# Altium project Powersupply.PrjPcb (part 2 of 2)

## Sheet Controll.SchDoc
size A1
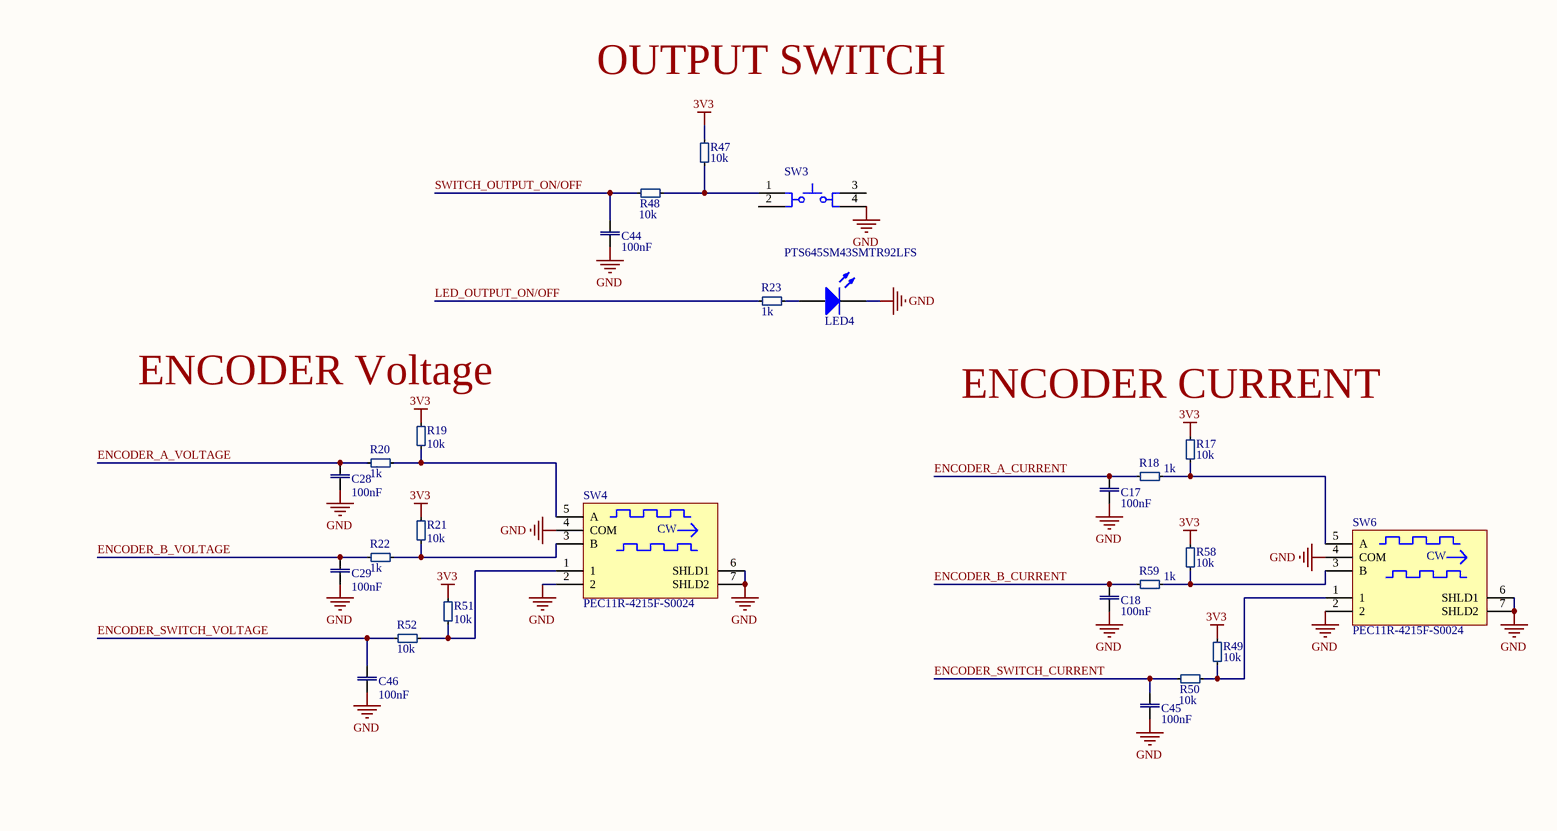
[diagram p4: Controll.SchDoc, top left]
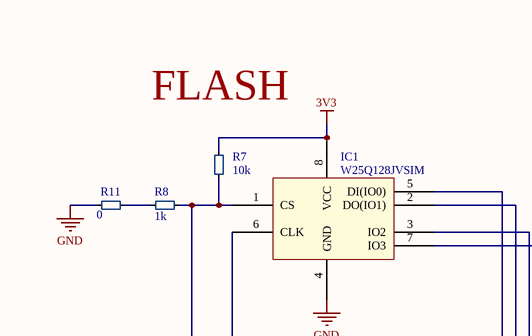
[diagram p5: Controll.SchDoc, top right]
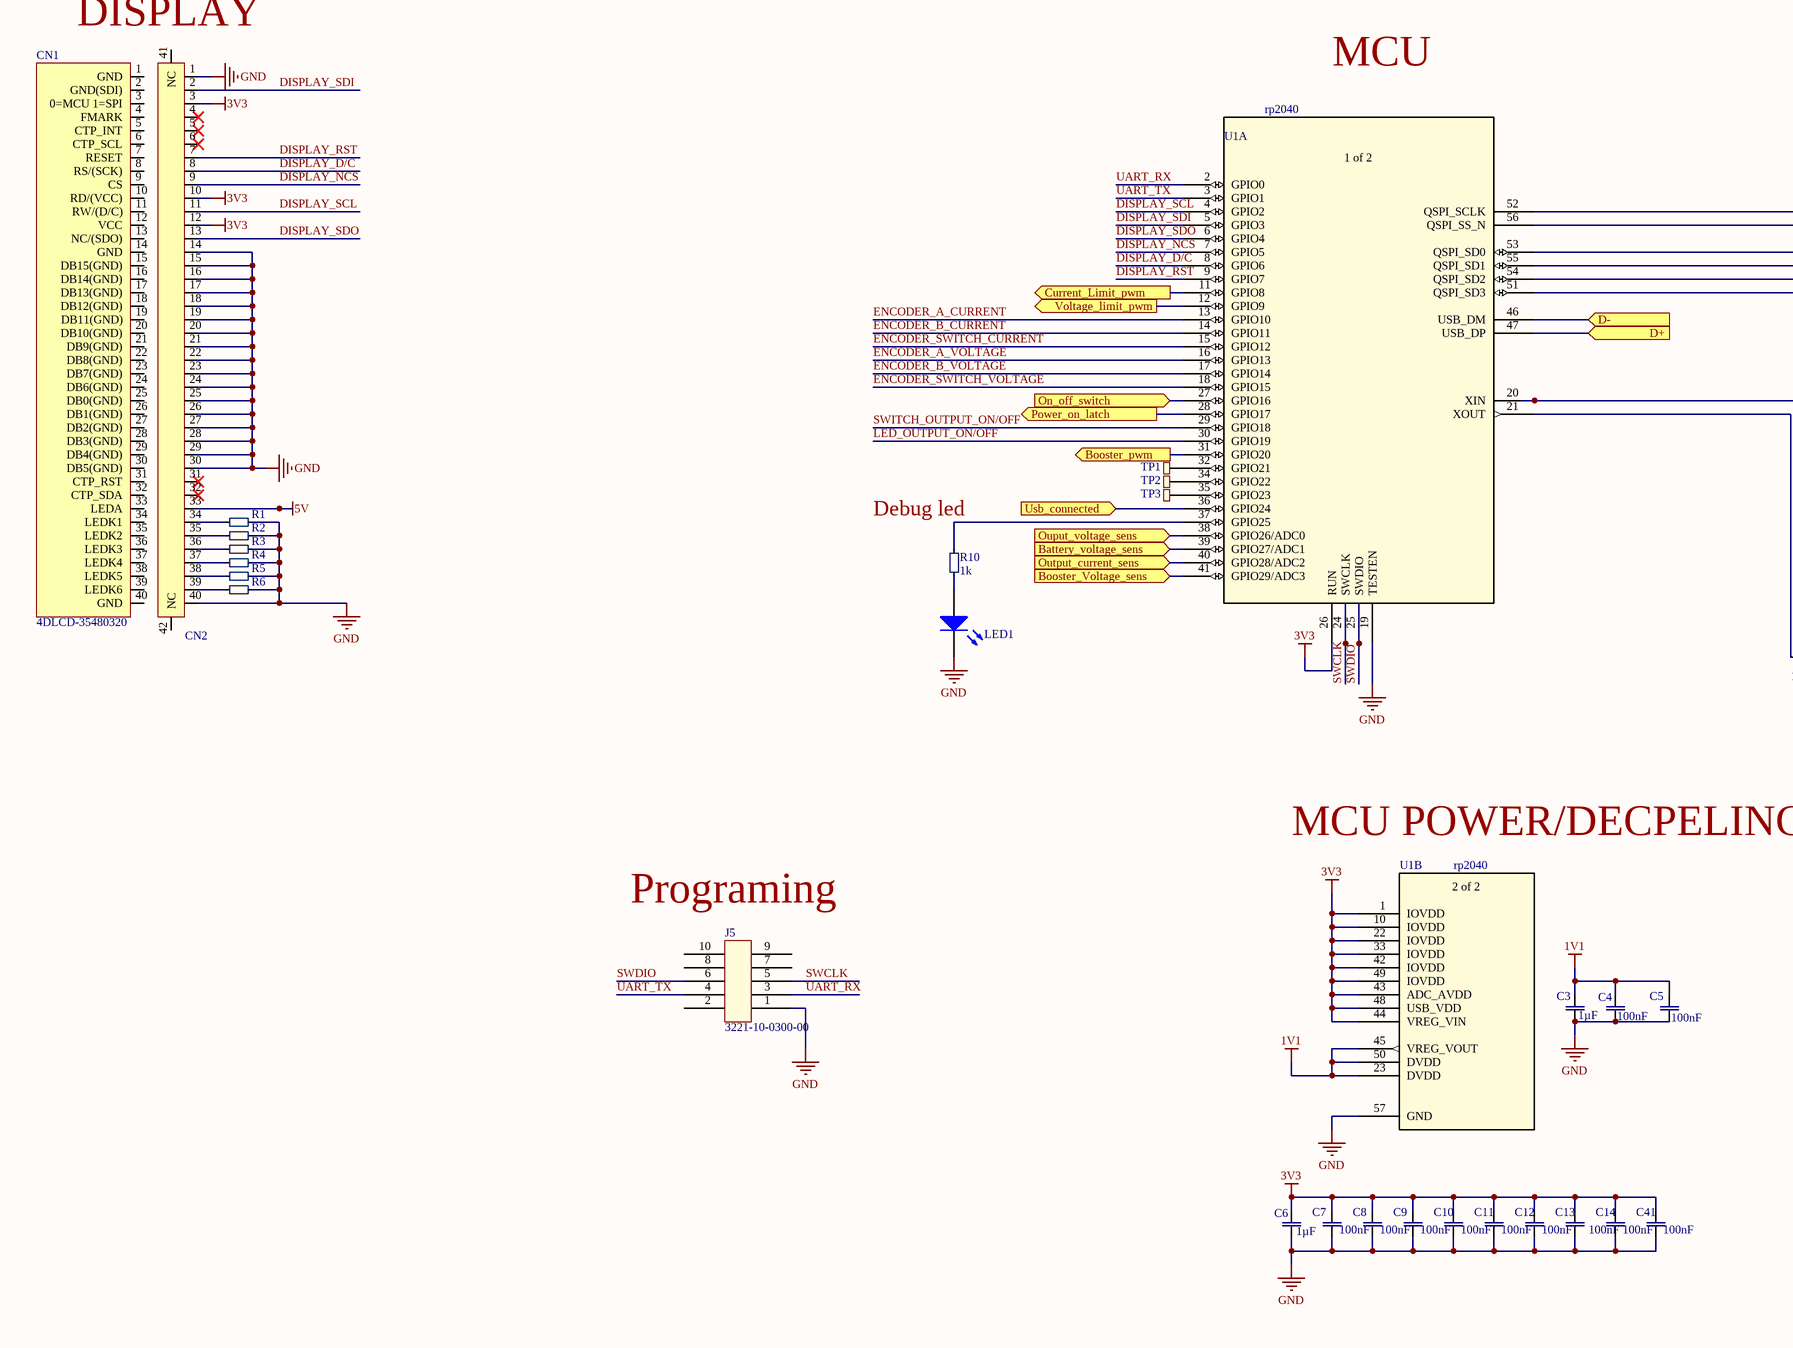
[diagram p6: Controll.SchDoc, bottom left]
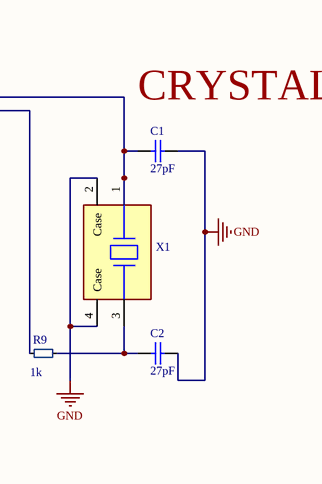
[diagram p7: Controll.SchDoc, bottom right]

### Parts
C1  Capacitance: 27pF  [cap0402]  (hidden comment: 04025A270KAT2A)
C2  Capacitance: 27pF  [cap0402]  (hidden comment: 04025A270KAT2A)
C3  Capacitance: 1µF  [CAP0805]  (hidden comment: CL21B105KBFNNNG)
C4  Capacitance: 100nF  [cap0402]  (hidden comment: GRM155R71H104ME14D)
C5  Capacitance: 100nF  [cap0402]  (hidden comment: GRM155R71H104ME14D)
C6  Capacitance: 1µF  [CAP0805]  (hidden comment: CL21B105KBFNNNG)
C7  Capacitance: 100nF  [cap0402]  (hidden comment: GRM155R71H104ME14D)
C8  Capacitance: 100nF  [cap0402]  (hidden comment: GRM155R71H104ME14D)
C9  Capacitance: 100nF  [cap0402]  (hidden comment: GRM155R71H104ME14D)
C10  Capacitance: 100nF  [cap0402]  (hidden comment: GRM155R71H104ME14D)
C11  Capacitance: 100nF  [cap0402]  (hidden comment: GRM155R71H104ME14D)
C12  Capacitance: 100nF  [cap0402]  (hidden comment: GRM155R71H104ME14D)
C13  Capacitance: 100nF  [cap0402]  (hidden comment: GRM155R71H104ME14D)
C14  Capacitance: 100nF  [cap0402]  (hidden comment: GRM155R71H104ME14D)
C17  Capacitance: 100nF  [cap0402]  (hidden comment: GRM155R71H104ME14D)
C18  Capacitance: 100nF  [cap0402]  (hidden comment: GRM155R71H104ME14D)
C28  Capacitance: 100nF  [cap0402]  (hidden comment: GRM155R71H104ME14D)
C29  Capacitance: 100nF  [cap0402]  (hidden comment: GRM155R71H104ME14D)
C41  Capacitance: 100nF  [cap0402]  (hidden comment: GRM155R71H104ME14D)
C44  Capacitance: 100nF  [cap0402]  (hidden comment: GRM155R71H104ME14D)
C45  Capacitance: 100nF  [cap0402]  (hidden comment: GRM155R71H104ME14D)
C46  Capacitance: 100nF  [cap0402]  (hidden comment: GRM155R71H104ME14D)
CN1  4DLCD-35480320  (mechanical)
CN2  505110-4091  [505110-4091-Footprint-1]  (value not drawn)
IC1  W25Q128JVSIM  [SOIC127P780X195-8N]
J5  3221-10-0300-00  [New footprint 1]
LED1  150080BS75000  [0805_A]  (value not drawn)
LED4  150080BS75000  [0805_A]  (value not drawn)
R1  RC0402FR-07100RL  [RESC0402(1005)_N]  (value not drawn)
R2  RC0402FR-07100RL  [RESC0402(1005)_N]  (value not drawn)
R3  RC0402FR-07100RL  [RESC0402(1005)_N]  (value not drawn)
R4  RC0402FR-07100RL  [RESC0402(1005)_N]  (value not drawn)
R5  RC0402FR-07100RL  [RESC0402(1005)_N]  (value not drawn)
R6  RC0402FR-07100RL  [RESC0402(1005)_N]  (value not drawn)
R7  Resistance: 10k  [SMD_0402(1005)_M]  (hidden comment: RC0402FR-0710KL)
R8  Resistance: 1k  [SMD_0402(1005)_M]  (hidden comment: RC0402FR-071KL)
R9  Resistance: 1k  [SMD_0402(1005)_M]  (hidden comment: RC0402FR-071KL)
R10  Resistance: 1k  [SMD_0402(1005)_M]  (hidden comment: RC0402FR-071KL)
R11  Resistance: 0  [SMD_0402(1005)_M]  (hidden comment: RC0402FR-070RL)
R17  Resistance: 10k  [SMD_0402(1005)_M]  (hidden comment: RC0402FR-0710KL)
R18  Resistance: 1k  [SMD_0402(1005)_M]  (hidden comment: RC0402FR-071KL)
R19  Resistance: 10k  [SMD_0402(1005)_M]  (hidden comment: RC0402FR-0710KL)
R20  Resistance: 1k  [SMD_0402(1005)_M]  (hidden comment: RC0402FR-071KL)
R21  Resistance: 10k  [SMD_0402(1005)_M]  (hidden comment: RC0402FR-0710KL)
R22  Resistance: 1k  [SMD_0402(1005)_M]  (hidden comment: RC0402FR-071KL)
R23  Resistance: 1k  [SMD_0402(1005)_M]  (hidden comment: RC0402FR-071KL)
R47  Resistance: 10k  [SMD_0402(1005)_M]  (hidden comment: RC0402FR-0710KL)
R48  Resistance: 10k  [SMD_0402(1005)_M]  (hidden comment: RC0402FR-0710KL)
R49  Resistance: 10k  [SMD_0402(1005)_M]  (hidden comment: RC0402FR-0710KL)
R50  Resistance: 10k  [SMD_0402(1005)_M]  (hidden comment: RC0402FR-0710KL)
R51  Resistance: 10k  [SMD_0402(1005)_M]  (hidden comment: RC0402FR-0710KL)
R52  Resistance: 10k  [SMD_0402(1005)_M]  (hidden comment: RC0402FR-0710KL)
R58  Resistance: 10k  [SMD_0402(1005)_M]  (hidden comment: RC0402FR-0710KL)
R59  Resistance: 1k  [SMD_0402(1005)_M]  (hidden comment: RC0402FR-071KL)
SW3  PTS645SM43SMTR92LFS  [CKCP-PTS645S_V]
SW4  PEC11R-4215F-S0024  [BOUR-PEC11R-4XXXF-SXXXX_V]
SW6  PEC11R-4215F-S0024  [BOUR-PEC11R-4XXXF-SXXXX_V]
TP1  testpoit  [testpoit-Footprint-1]  (value not drawn)
TP2  testpoit  [testpoit-Footprint-1]  (value not drawn)
TP3  testpoit  [testpoit-Footprint-1]  (value not drawn)
U1  rp2040  [rp2040-Footprint-1]  (parts A,B of 2)
X1  FL1200112  [FP-FL1200112-MFG]  (value not drawn)

### Ports
Battery_voltage_sens (in), Booster_pwm (out), Booster_Voltage_sens (in), Current_Limit_pwm (out), D+ (in), D- (in), On_off_switch (in), Ouput_voltage_sens (in), Output_current_sens (in), Power_on_latch (out), Usb_connected (in), Voltage_limit_pwm (out)

### Nets
1V1: C3.2 C4.2 C5.2 U1.23(DVDD) U1.45(VREG_VOUT) U1.50(DVDD)
3V3: C6.2 C7.2 C8.2 C9.2 C10.2 C11.2 C12.2 C13.2 C14.2 C41.2 CN2.3 CN2.10 CN2.12 IC1.8(VCC) R7.2 R17.2 R19.2 R21.2 R47.2 R49.2 R51.2 R58.2 U1.1(IOVDD) U1.10(IOVDD) U1.22(IOVDD) U1.26(RUN) U1.33(IOVDD) U1.42(IOVDD) U1.43(ADC_AVDD) U1.44(VREG_VIN) U1.48(USB_VDD) U1.49(IOVDD)
5V: CN2.33
GND: C1.1 C2.1 C3.1 C4.1 C5.1 C6.1 C7.1 C8.1 C9.1 C10.1 C11.1 C12.1 C13.1 C14.1 C17.1 C18.1 C28.1 C29.1 C41.1 C44.1 C45.1 C46.1 CN2.1 CN2.14 CN2.15 CN2.16 CN2.17 CN2.18 CN2.19 CN2.20 CN2.21 CN2.22 CN2.23 CN2.24 CN2.25 CN2.26 CN2.27 CN2.28 CN2.29 CN2.30 CN2.40 IC1.4(GND) J5.1 LED1.1(K) LED4.1(K) R1.2 R2.2 R3.2 R4.2 R5.2 R6.2 R11.1 SW3.4 SW4.2 SW4.4(COM) SW4.6(SHLD1) SW4.7(SHLD2) SW6.2 SW6.4(COM) SW6.6(SHLD1) SW6.7(SHLD2) U1.19(TESTEN) U1.57(GND) X1.2(Case) X1.4(Case)
DISPLAY_D/C: CN2.8 U1.8(GPIO6)
DISPLAY_NCS: CN2.9 U1.7(GPIO5)
DISPLAY_RST: CN2.7 U1.9(GPIO7)
DISPLAY_SCL: CN2.11 U1.4(GPIO2)
DISPLAY_SDI: CN2.2 U1.5(GPIO3)
DISPLAY_SDO: CN2.13 U1.6(GPIO4)
ENCODER_A_CURRENT: C17.2 R18.1 U1.13(GPIO10)
ENCODER_A_VOLTAGE: C28.2 R20.1 U1.16(GPIO13)
ENCODER_B_CURRENT: C18.2 R59.1 U1.14(GPIO11)
ENCODER_B_VOLTAGE: C29.2 R22.1 U1.17(GPIO14)
ENCODER_SWITCH_CURRENT: C45.2 R50.2 U1.15(GPIO12)
ENCODER_SWITCH_VOLTAGE: C46.2 R52.2 U1.18(GPIO15)
LED_OUTPUT_ON/OFF: R23.2 U1.30(GPIO19)
SWCLK: J5.5 U1.24(SWCLK)
SWDIO: J5.6 U1.25(SWDIO)
SWITCH_OUTPUT_ON/OFF: C44.2 R48.2 U1.29(GPIO18)
UART_RX: J5.3 U1.2(GPIO0)
UART_TX: J5.4 U1.3(GPIO1)
NetC1_2: C1.2 U1.20(XIN) X1.1(1_Xtal)
NetC2_2: C2.2 R9.2 X1.3(2_Xtal)
NetC42_2: U1.40(GPIO28/ADC2) ; port Output_current_sens
NetC43_2: U1.27(GPIO16) ; port On_off_switch
NetCN2_34: CN2.34 R1.1
NetCN2_35: CN2.35 R2.1
NetCN2_36: CN2.36 R3.1
NetCN2_37: CN2.37 R4.1
NetCN2_38: CN2.38 R5.1
NetCN2_39: CN2.39 R6.1
NetD5_1: U1.28(GPIO17) ; port Power_on_latch
NetIC1_1: IC1.1(CS) R7.1 R8.1 U1.56(QSPI_SS_N)
NetIC1_2: IC1.2(DO(IO1)) U1.55(QSPI_SD1)
NetIC1_3: IC1.3(IO2) U1.54(QSPI_SD2)
NetIC1_5: IC1.5(DI(IO0)) U1.53(QSPI_SD0)
NetIC1_6: IC1.6(CLK) U1.52(QSPI_SCLK)
NetIC1_7: IC1.7(IO3) U1.51(QSPI_SD3)
NetLED1_2: LED1.2(A) R10.1
NetLED4_2: LED4.2(A) R23.1
NetQ3_2: U1.31(GPIO20) ; port Booster_pwm
NetR8_2: R8.2 R11.2
NetR9_1: R9.1 U1.21(XOUT)
NetR10_2: R10.2 U1.37(GPIO25)
NetR14_2: U1.47(USB_DP) ; port D+
NetR16_2: U1.46(USB_DM) ; port D-
NetR17_1: R17.1 R18.2 SW6.5(A)
NetR19_1: R19.1 R20.2 SW4.5(A)
NetR21_1: R21.1 R22.2 SW4.3(B)
NetR24_1: U1.38(GPIO26/ADC0) ; port Ouput_voltage_sens
NetR32_1: U1.12(GPIO9) ; port Voltage_limit_pwm
NetR35_1: U1.11(GPIO8) ; port Current_Limit_pwm
NetR47_1: R47.1 R48.1 SW3.1
NetR49_1: R49.1 R50.1 SW6.1
NetR51_1: R51.1 R52.1 SW4.1
NetR58_1: R58.1 R59.2 SW6.3(B)
NetR60_1: U1.36(GPIO24) ; port Usb_connected
NetR63_1: U1.39(GPIO27/ADC1) ; port Battery_voltage_sens
NetR64_1: U1.41(GPIO29/ADC3) ; port Booster_Voltage_sens
NetTP1_1: TP1.1 U1.32(GPIO21)
NetTP2_1: TP2.1 U1.34(GPIO22)
NetTP3_1: TP3.1 U1.35(GPIO23)

Not connected (* = marked no-connect by the designer): CN1 1(GND) 2(GND(SDI)) 3(0=MCU_1=SPI) 4(FMARK) 5(CTP_INT) 6(CTP_SCL) 7(RESET) 8(RS/(SCK)) 9(CS) 10(RD/(VCC)) 11(RW/(D/C)) 12(VCC) 13(NC/(SDO)) 14(GND) 15(DB15(GND)) 16(DB14(GND)) 17(DB13(GND)) 18(DB12(GND)) 19(DB11(GND)) 20(DB10(GND)) 21(DB9(GND)) 22(DB8(GND)) 23(DB7(GND)) 24(DB6(GND)) 25(DB0(GND)) 26(DB1(GND)) 27(DB2(GND)) 28(DB3(GND)) 29(DB4(GND)) 30(DB5(GND)) 31(CTP_RST) 32(CTP_SDA) 33(LEDA) 34(LEDK1) 35(LEDK2) 36(LEDK3) 37(LEDK4) 38(LEDK5) 39(LEDK6) 40(GND); CN2 4* 5* 6* 31* 32* 41(NC) 42(NC); J5 2 7 8 9 10; SW3 2 3

### Notes on the sheet
- OUTPUT SWITCH
- (near R19) ENCODER Voltage
- (near R17) ENCODER CURRENT
- FLASH
- DISPLAY
- MCU
- (near C1) CRYSTALL
- (near R10) Debug led
- MCU POWER/DECPELING
- (near J5) Programing
- (in symbol CMP-ROOT-00012-4) CW
- (in symbol CMP-ROOT-00039-8, part A) 1 of 2
- (in symbol CMP-ROOT-00039-8, part B) 2 of 2

### Library data of the parts
C1 C2 = CMP-0001-00026-3: 0402 27 pF 50 V ±10 % Tolerance C0G/NP0 SMT Multilayer Ceramic Capacitor; Tolerance: 10%; Voltage Rating: 50V; Case/Package: 0402; RoHS: Yes; Mount: Surface Mount; Capacitor Type: Ceramic; LCSC Part#: C2168514
C3 C6 = CMP-0001-00012-5: SAMSUNG ELECTRO-MECHANICS - CL21B105KBFNNNG - MLCC CAPACITORS; Voltage Rating: 50V; Dielectric: X7R; Material: Ceramic; Tolerance: 10%; RoHS: Yes; Termination: Wraparound; Case Code (Imperial): 0805; Min Operating Temperature: -55°C; Package Quantity: 3000; Packaging: Tape and Reel; Length: 2mm; Width: 0.049inch; Thickness: 0.053inch; Mount: Surface Mount; Contact Plating: Tin; Voltage: 50V; Max Operating Temperature: 125°C; Case Code (Metric): 2012; Depth: 1.25mm; Case/Package: 0805; Capacitor Type: Ceramic; LCSC Part#: -
C4 C5 C7-C14 C41 = CMP-0001-00001-10: 0402 0.1 uF 50 V ±20% Tolerance X7R SMT Monolithic Ceramic Chip Capacitor; Value: 100nF; Voltage Rating: 50V; Length: 0.039inch; Packaging: Cut Tape; Max Operating Temperature: 125°C; Min Operating Temperature: -55°C; Mount: Surface Mount; Case/Package: 0402; Tolerance: 20%; Width: 0.02inch; Capacitor Type: Ceramic; Thickness: 0.022inch; Pins: 2; RoHS: Yes; LCSC Part#: C182412
C17 C18 C28 C29 C44-C46 = CMP-0001-00001-10: 0402 0.1 uF 50 V ±20% Tolerance X7R SMT Monolithic Ceramic Chip Capacitor; Voltage Rating: 50V; Value: 100nF; Packaging: Cut Tape; Tolerance: 20%; Capacitor Type: Ceramic; Width: 0.02inch; Pins: 2; Max Operating Temperature: 125°C; Length: 0.039inch; Mount: Surface Mount; Thickness: 0.022inch; RoHS: Yes; Min Operating Temperature: -55°C; Case/Package: 0402; LCSC Part#: C182412
CN1 = CMP-ROOT-00025-4: Non-Touch Graphic LCD Display Module Transmissive Red, Green, Blue (RGB) TFT - Color MCU, SPI 3.5" (88.90mm) 320 x 480; Mount: SMD; RoHS: Yes; Case/Package: 3.5"; LCSC Part#: -
CN2 = CMP-003-0002-6: MOLEX - 505110-4091 - FFC / FPC Board Connector, 0.5 mm, 40 Contacts, Receptacle, Easy-On 505110 Series, Surface Mount; Current Rating: 500mA; Number of Contacts: 40; Actuator Material: Nylon,Glass,Polyamide; Pitch: 0.5mm; Mating Cycles: 25; Voltage Rating: 50V; Halogen Free: Low Halogen; Gender: Receptacle; Packaging: Tape and Reel; Housing Color: Beige; Min Operating Temperature: -40°C; REACH SVHC: Unknown; Number of Circuits: 40; Flammability Rating: UL94 V-0; Max Operating Temperature: 105°C; Mount: Surface Mount; Contact Plating: Gold; System: Connector; Contact Material: Bronze; Number of Pins: 40; Number of Rows: 1; Number of Positions: 40; Height: 1.9mm; Housing Material: Polymer; Termination: Solder; RoHS: Yes; Orientation: Right Angle; LCSC Part#: -
IC1 = CMP-006-0008-2: NOR Flash Serial (SPI, Dual SPI, Quad SPI) 3V/3.3V 128M-bit 16M x 8 6ns 8-Pin SOIC Tube; LCSC Part#: C2613930
J5 = CMP-003-0010-2: Conn Shrouded Header HDR 10 POS 1.27mm Solder ST SMD; Number of Positions: 10; Row Spacing: 0.05inch; System: Connector; Fastening Type: Pull; RoHS: Yes; Contact Type: Male Pin; Contact Shape: Square; Series: -; Connector Type: Header; Packaging: Tray; Insulation Material: Nylon; Flammability Rating: UL94 V-0; Max Operating Temperature: 105°C; Contact Material: Brass; Number of Pins: 10; RoHS Compliant: Yes; Pitch: 0.05inch; Contact Finish - Mating: GOLD; Number of Rows: 2; Min Operating Temperature: -40°C; Termination: Solder; Contact Plating: Gold; Mount: Surface Mount; LCSC Part#: -
LED1 LED4 = CMP-00002-2: SMD LED blue 3.5 V 0805, 150080BS75000, Würth Elektronik; Dominant Wavelength: 470nm; Luminous Intensity: 145mcd; Lens Style: Clear,Rectangular; Forward Current: 30mA; Test Current: 20mA; Forward Voltage: 3.2V; Viewing Angle: 140°; Length: 2mm; Width: 1.25mm; RoHS: Yes; Height: 0.7mm; Color: Blue; Packaging: Tape and Reel; REACH SVHC: Unknown; Max Operating Temperature: 85°C; Case Code (Imperial): 0805; Lead Free: Lead Free; Case Code (Metric): 2012; Case/Package: 0805; Min Operating Temperature: -40°C; Wavelength: 470nm; Package Quantity: 4000; Mount: Surface Mount; LCSC Part#: -
R1-R6 = CMP-001-0027-2: Res General Purpose Thick Film 0402 100 Ohm 1% 1/16W ±100ppm/°C Molded SMD Paper T/R; Voltage Rating (DC): 50V; Power Rating: 62.5mW; Resistance: 100; Max Power Dissipation: 63mW; Number of Pins: 2; Temperature Coefficient: 100ppm/°C; Packaging: Tape and Reel; Length: 1mm; Depth: 0.5mm; Height: 0.32mm; Lead Free: Lead Free; Case/Package: 0402; RoHS: Yes; Termination: SMD/SMT; Features: Moisture Resistant; Max Operating Temperature: 155°C; Composition: Thick Film; Min Operating Temperature: -55°C; Military Standard: Not; Number of Terminations: 2; Working Voltage: 50V; Voltage Rating: 50V; REACH SVHC: No SVHC; Case Code (Imperial): 0402; Width: 0.5mm; Case Code (Metric): 1005; Mount: SMD; Tolerance: 1%; LCSC Part#: C106232
R7 R17 R19 R21 R47-R52 R58 = CMP-008-0005-11: Surface Mount Thick Film Resistor, Rc Series, 10 Kohm, 62.5 Mw, - 1%, 50 V, 0402 [1005 Metric]; Voltage Rating: 50V; Power Rating: 62.5mW; Value: 10k; Temperature Coefficient: 100ppm/°C; Case/Package: 0402; Lead Pitch: 0.2mm; Tolerance: 1%; Composition: Thick Film; Voltage Rating (DC): 50V; Case Code (Metric): 1005; Width: 0.5mm; Lead Free: Lead Free; Number of Terminations: 2; Number of Pins: 2; Mount: SMD; Termination: SMD/SMT; Military Standard: Not; REACH SVHC: No SVHC; Length: 1mm; Depth: 0.5mm; Working Voltage: 50V; Packaging: Tape and Reel; Case Code (Imperial): 0402; Max Operating Temperature: 155°C; Height: 0.32mm; RoHS: Yes; Min Operating Temperature: -55°C; LCSC Part#: C60490
R8-R10 R18 R20 R22 R23 R59 = CMP-001-0000-9: Surface Mount Chip Resistor, Thick Film, RC Series, 1 kohm, 62.5 mW, 1%, 50 V, 0402 [1005 Metric]; Temperature Coefficient: 100ppm/°C; Value: 1k; Voltage Rating: 50V; Power Rating: 62.5mW; RoHS: Yes; Max Operating Temperature: 155°C; Width: 0.5mm; Case Code (Metric): 1005; Mount: SMD; Min Operating Temperature: -55°C; Lead Free: Lead Free; Military Standard: Not; Case Code (Imperial): 0402; Number of Pins: 2; Height: 0.32mm; Case/Package: 0402; Composition: Thick Film; Packaging: Tape and Reel; Length: 1mm; Tolerance: 1%; Depth: 0.5mm; Voltage Rating (DC): 50V; Termination: SMD/SMT; REACH SVHC: Unknown; LCSC Part#: C2935237
R11 = CMP-0001-00005-8: Res Thick Film 0402 0 Ohm Molded SMD SMD Paper T/R; Value: 0; Temperature Coefficient: 200ppm/°C; Power Rating: 62.5mW; Voltage Rating: 50V; Tolerance: 1%; Mount: Surface Mount; Contact Plating: Tin,Matte; Case/Package: 0402; Lead Free: Lead Free; Case Code (Metric): 1005; Composition: Thick Film; Min Operating Temperature: -55°C; Length: 1mm; Packaging: Tape and Reel; Max Operating Temperature: 155°C; Termination: SMD/SMT; Height: 0.35mm; RoHS: Yes; Width: 0.5mm; Case Code (Imperial): 0402; Radiation Hardening: No; LCSC Part#: C106231
SW3 = CMP-ROOT-00020-2: Case/Package: smd; RoHS: Yes; Mount: SMD; LCSC Part#: C221880
SW4 SW6 = CMP-ROOT-00012-4: BOURNS - PEC11R-4215F-S0024 - Rotary Encoder, Mechanical, Incremental, 24 PPR, 24 Detents, Vertical, With Momentary Push Switch; Hole Diameter: 1.8mm; Detent: Yes; Pulses per Revolution: 24; Output Type: Quadrature,Incremental; Number of Channels: 2; Type: Mechanical; Radiation Hardening: No; Orientation: Vertical; Min Operating Temperature: -30°C; Max Operating Temperature: 70°C; Termination: PC Pins; Case/Package: encoder; RoHS: Yes; Height: 13.4mm; Mount: Through Hole,Panel,PCB; Width: 12.5mm; Encoder Type: Mechanical; Pins: 5; Packaging: Bulk; Length: 21.5mm; Package Quantity: 150; REACH SVHC: No SVHC; Built in Switch: Yes; LCSC Part#: C143790
TP1-TP3 = CMP-003-0009-3: 2 mm singel sided testpoint; System: Connector; Number of Positions: 1; Mount: TH; RoHS: Yes; LCSC Part#: -
U1 = CMP-ROOT-00039-8: ARM® Cortex®-M0+ series Microcontroller IC 32-Bit Dual-Core 133MHz - External Program Memory 56-QFN (7x7); Mount: SMD; Case/Package: 56-VFQFN Exposed Pad; RoHS: Yes; LCSC Part#: C2040
X1 = CMP-ROOT-00046-2: Crystal 12MHz ±30ppm (Tol) ±30ppm (Stability) 18pF FUND 80Ohm 4-Pin SMD T/R; RoHS: Yes; Case/Package: SMD/SMT; Mount: Surface Mount; LCSC Part#: C1985665

## Nets that join several sheets
3V3: Regulator (7 pins), power (8 pins), Controll (32 pins)
5V: power (6 pins), Controll (CN2.33)
GND: Regulator (36 pins), power (33 pins), Controll (65 pins)
NetC42_2: Regulator (C42.2 R46.1), Controll (U1.40)
NetC43_2: power (C43.2 R44.1), Controll (U1.27)
NetD5_1: power (D5.1), Controll (U1.28)
NetQ3_2: Regulator (Q3.2), Controll (U1.31)
NetR14_2: power (R14.2), Controll (U1.47)
NetR16_2: power (R16.2), Controll (U1.46)
NetR24_1: Regulator (R24.1 R25.2), Controll (U1.38)
NetR32_1: Regulator (R32.1), Controll (U1.12)
NetR35_1: Regulator (R35.1), Controll (U1.11)
NetR60_1: power (R60.1 R61.2), Controll (U1.36)
NetR63_1: power (R63.1 R70.2), Controll (U1.39)
NetR64_1: Regulator (R64.1 R65.2), Controll (U1.41)
VBAT: Regulator (C19.1 C21.2 L2.1), power (6 pins)